# Altium schematic sheet gnss_quectel_lc29hea.SchDoc
size A
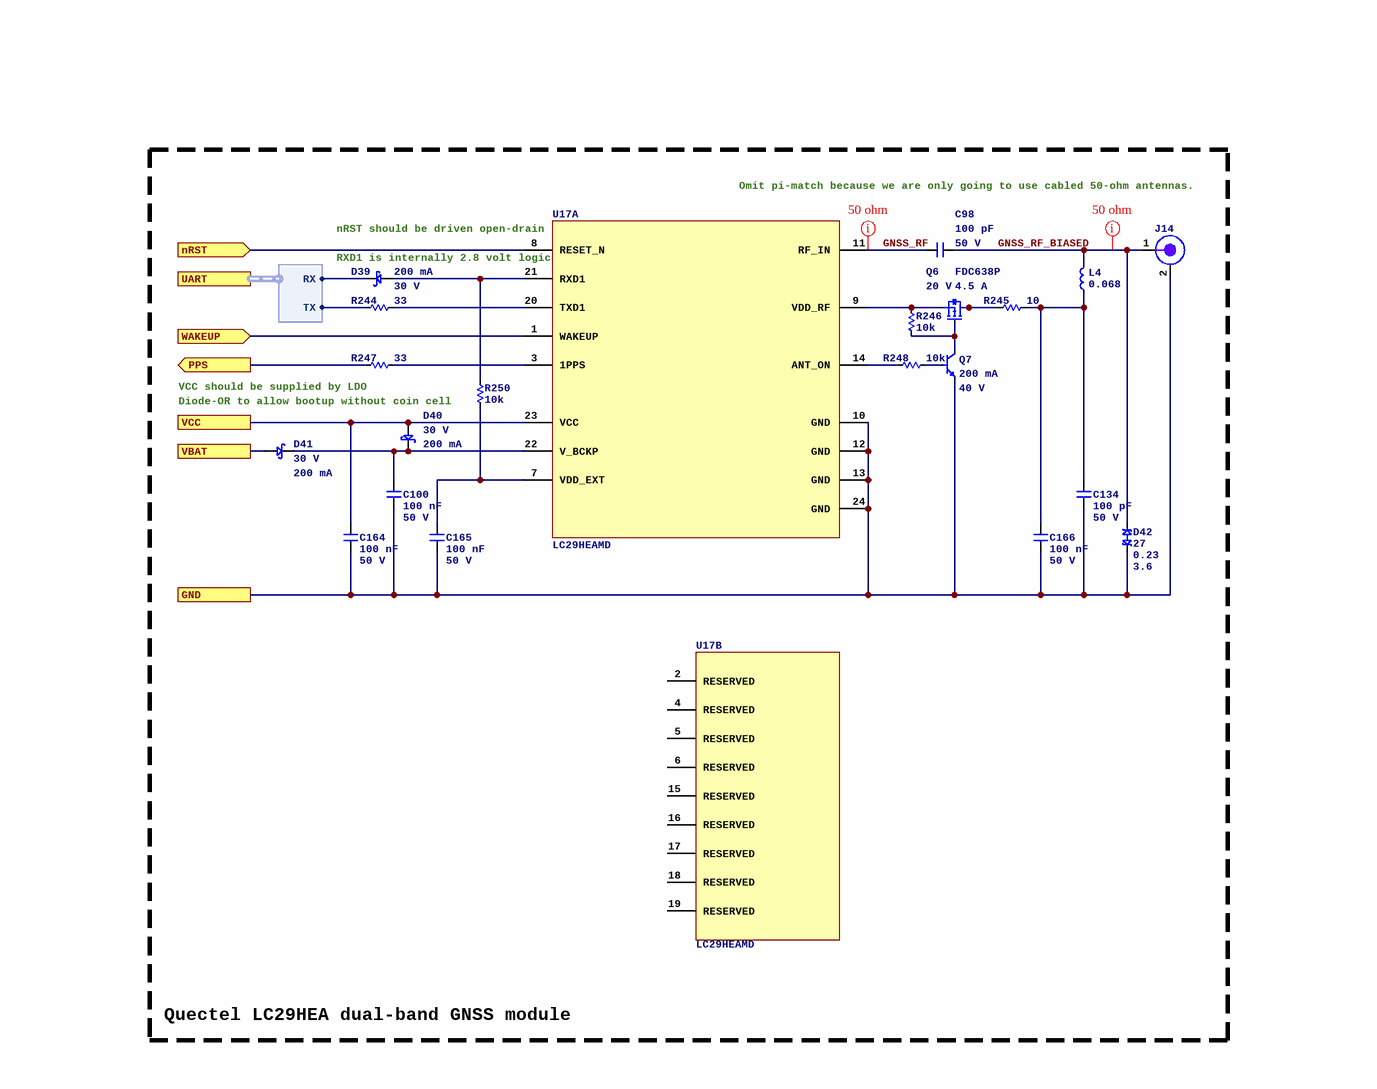
[diagram p0: gnss_quectel_lc29hea.SchDoc]

## Parts
C98  Capacitance: 100 pF  Voltage Rating: 50 V  [C0402]  (hidden comment: 0402CG101J500NT)
C100  Capacitance: 100 nF  Voltage Rating: 50 V  [C0402]  (hidden comment: CL05B104KB54PNC)
C134  Capacitance: 100 pF  Voltage Rating: 50 V  [C0402]  (hidden comment: 0402CG101J500NT)
C164  Capacitance: 100 nF  Voltage Rating: 50 V  [C0402]  (hidden comment: CL05B104KB54PNC)
C165  Capacitance: 100 nF  Voltage Rating: 50 V  [C0402]  (hidden comment: CL05B104KB54PNC)
C166  Capacitance: 100 nF  Voltage Rating: 50 V  [C0402]  (hidden comment: CL05B104KB54PNC)
D39  Current: 200 mA  Vr: 30 V  [SOD523]  (hidden comment: BAT54XV2T1G)
D40  Current: 200 mA  Vr: 30 V  [SOD523]  (hidden comment: BAT54XV2T1G)
D41  Current: 200 mA  Vr: 30 V  [SOD523]  (hidden comment: BAT54XV2T1G)
D42  Power (W): 27  Capacitance (pF): 0.23  Standoff (V): 3.6  [TI_DPY0002A]  (hidden comment: TPD1E01B04DPYR)
J14  RFPC-SMA14-FN-A  [GCT_RFPC-SMA14-FN-A]  (value not drawn)
L4  Inductance (µH): 0.068  [L0603_0.95MM]  (hidden comment: LQW18AN68NJ80D)
Q6  FDC638P  Voltage: 20 V  Current: 4.5 A  [6SOT23]
Q7  Current: 200 mA  Voltage: 40 V  [3SOT523]  (hidden comment: MMBT3904T)
R244  value 33  [R0402]  (hidden comment: 0402WGF330JTCE)
R245  value 10  [R2512]  (hidden comment: RTT2510R0FTE)
R246  value 10k  [R0402]  (hidden comment: 0402WGF1002TCE)
R247  value 33  [R0402]  (hidden comment: 0402WGF330JTCE)
R248  value 10k  [R0402]  (hidden comment: 0402WGF1002TCE)
R250  value 10k  [R0402]  (hidden comment: 0402WGF1002TCE)
U17  LC29HEAMD  [QUECTEL_LC29H]  (parts A,B of 2)

## Ports
GND, nRST (in), PPS (out), UART (harness UART), VBAT, VCC, WAKEUP (in)

## Harnesses
UART: RX, TX

## Nets
GND: C100.2 C134.2 C164.2 C165.2 C166.2 D42.1 J14.2(GND) Q7.2(E) U17.10(GND) U17.12(GND) U17.13(GND) U17.24(GND) ; port GND
GNSS_RF: C98.1 U17.11(RF_IN)
GNSS_RF_BIASED: C98.2 D42.2 J14.1(RF) L4.2
nRST: U17.8(RESET_N) ; port nRST
PPS: R247.2 ; port PPS
VBAT: D41.1 ; port VBAT
VCC: C164.1 D40.1 U17.23(VCC) ; port VCC
WAKEUP: U17.1(WAKEUP) ; port WAKEUP
NetC100_1: C100.1 D40.2 D41.2 U17.22(V_BCKP)
NetC134_1: C134.1 C166.1 L4.1 R245.1
NetC165_1: C165.1 R250.2 U17.7(VDD_EXT)
NetD39_1: D39.1 R250.1 U17.21(RXD1)
NetD39_2: D39.2 ; port UART.RX
NetQ6_1: Q6.1 Q6.2 Q6.5 Q6.6 R245.2
NetQ6_3: Q6.3 Q7.3(C) R246.2
NetQ6_4: Q6.4 R246.1 U17.9(VDD_RF)
NetQ7_1: Q7.1(B) R248.1
NetR244_1: R244.1 U17.20(TXD1)
NetR244_2: R244.2 ; port UART.TX
NetR247_1: R247.1 U17.3(1PPS)
NetR248_2: R248.2 U17.14(ANT_ON)

Not connected (* = marked no-connect by the designer): U17 2(RESERVED) 4(RESERVED) 5(RESERVED) 6(RESERVED) 15(RESERVED) 16(RESERVED) 17(RESERVED) 18(RESERVED) 19(RESERVED)

## Layout directives
net class SE_50: GNSS_RF, GNSS_RF_BIASED

## Notes on the sheet
- nRST should be driven open-drain
- Omit pi-match because we are only going to use cabled 50-ohm antennas.
- (near D39) RXD1 is internally 2.8 volt logic
- VCC should be supplied by LDO
- Diode-OR to allow bootup without coin cell
- Quectel LC29HEA dual-band GNSS module

## Library data of the parts
C98 C134 = 0402CG101J500NT: Manufacturer: FH(Guangdong Fenghua Advanced Tech); Dielectric: C0G; ComponentLink1URL: https://wmsc.lcsc.com/wmsc/upload/file/pdf/v2/lcsc/2304140030_FH--Guangdong-Fenghua-Advanced-Tech-0402CG101J500NT_C1546.pdf; ComponentLink1Description: Datasheet; Manufacturer Part Number: 0402CG101J500NT; Package: 0402; Supplier 2: LCSC; Supplier Part Number 2: C1546
C100 C164-C166 = CL05B104KB54PNC: Manufacturer: Samsung Electro-Mechanics; Dielectric: X7R; ComponentLink1URL: https://wmsc.lcsc.com/wmsc/upload/file/pdf/v2/lcsc/2304140030_Samsung-Electro-Mechanics-CL05B104KB54PNC_C307331.pdf; ComponentLink1Description: Datasheet; Manufacturer Part Number: CL05B104KB54PNC; Package: 0402; Supplier 2: LCSC; Supplier Part Number 2: C307331
D39-D41 = BAT54XV2T1G: ON Semi BAT54XV2T1G; SMT Schottky Diode; 30V 200mA; 5ns; 2-Pin SOD-523; Manufacturer: onsemi; Supplier 1: DigiKey; Supplier Part Number 1: BAT54XV2T1GOSCT-ND; Manufacturer Part Number: BAT54XV2T1G; Supplier 2: LCSC; Supplier Part Number 2: C81572; ComponentLink1Description: Datasheet; ComponentLink1URL: https://www.onsemi.com/pdf/datasheet/bat54xv2t1-d.pdf; Diode Type: Schottky; Supplier 3: Mouser; Supplier Part Number 3: 863-BAT54XV2T1G
D42 = TPD1E01B04DPYR: 3.6 V bidirectional ESD protection diode for high-speed data lines; Manufacturer: Texas Instruments; Supplier 1: DigiKey; Supplier Part Number 1: 296-48721-1-ND; Manufacturer Part Number: TPD1E01B04DPYR; ComponentLink1URL: https://www.ti.com/lit/ds/symlink/tpd1e01b04.pdf; ComponentLink1Description: Datasheet; Polarity: Bidirectional; Supplier 2: LCSC; Supplier Part Number 2: C779389; Supplier 3: Mouser; Supplier Part Number 3: 595-TPD1E01B04DPYR
J14 = RFPC-SMA14-FN-A: SMA Connector Jack, Female Socket Panel Mount, Through Hole, Right Angle Solder, IP68 unmated; Manufacturer: GCT (Gradconn); Supplier 1: DigiKey; Supplier Part Number 1: 2072-RFPC-SMA14-FN-A-ND; Manufacturer Part Number: RFPC-SMA14-FN-A; ComponentLink1Description: Datasheet; ComponentLink1URL: https://www.gradconn.com/Files/Drawings/RFPC-SMA14-FN.pdf; Supplier 2: LCSC; Supplier Part Number 2: C3173272; Supplier 3: Mouser; Supplier Part Number 3: 640-RFPCSMA14FNA
L4 = LQW18AN68NJ80D: 68 nH chip inductor, ±5%; Manufacturer: Murata; Current Rating (mA): 630; DCR (mOhms): 380; Supplier 1: DigiKey; Supplier Part Number 1: LQW18AN68NJ80D-ND; Manufacturer Part Number: LQW18AN68NJ80D; Supplier 2: LCSC; Supplier Part Number 2: C269832; Supplier 3: Mouser; Supplier Part Number 3: 81-LQW18AN68NJ80D; ComponentLink1Description: Datasheet; ComponentLink1URL: https://www.mouser.com/datasheet/2/281/1/JELF243A_0102-3158940.pdf
Q6 = FDC638P: MOSFET P-CH 20V 4.5A SSOT-6; Manufacturer: onsemi; Channel Type: P-channel; Supplier 1: DigiKey; ComponentLink1URL: https://www.onsemi.com/pdf/datasheet/fdc638p-d.pdf; ComponentLink1Description: Datasheet; Supplier Part Number 1: FDC638PCT-ND; Manufacturer Part Number: FDC638P; Supplier 2: LCSC; Supplier Part Number 2: C241772; Supplier 3: Mouser; Supplier Part Number 3: 512-FDC638P
Q7 = MMBT3904T: Bipolar (BJT) Transistor NPN 40 V 200 mA 300MHz 150 mW Surface Mount SOT-523; Manufacturer: Shenzhen Slkormicro Semicon Co., Ltd.; Supplier 1: DigiKey; Supplier Part Number 1: 5399-MMBT3904TCT-ND; Manufacturer Part Number: MMBT3904T; ComponentLink1Description: Datasheet; ComponentLink1URL: https://mm.digikey.com/Volume0/opasdata/d220001/medias/docus/7136/5399_MMBT3904T%20SOT-523.pdf; Supplier 2: LCSC; Supplier Part Number 2: C61616; Polarity: NPN
R244 R247 = 0402WGF330JTCE: Manufacturer: UNI-ROYAL(Uniroyal Elec); Tolerance: 1%; Temperature Coefficient: ±100ppm/?; Power Rating (mW): 62.5; ComponentLink1Description: Datasheet; ComponentLink1URL: https://wmsc.lcsc.com/wmsc/upload/file/pdf/v2/lcsc/2205311900_UNI-ROYAL-Uniroyal-Elec-0402WGF330JTCE_C25105.pdf; Manufacturer Part Number: 0402WGF330JTCE; Package: 0402; Supplier 2: LCSC; Supplier Part Number 2: C25105
R245 = RTT2510R0FTE: Manufacturer: RALEC; Tolerance: 1%; Temperature Coefficient: ±100ppm/?; Power Rating (mW): 1000; ComponentLink1Description: Datasheet; ComponentLink1URL: https://wmsc.lcsc.com/wmsc/upload/file/pdf/v2/lcsc/2304140030_RALEC-RTT2510R0FTE_C105071.pdf; Manufacturer Part Number: RTT2510R0FTE; Package: 2512; Supplier 2: LCSC; Supplier Part Number 2: C105071
R246 R248 R250 = 0402WGF1002TCE: Manufacturer: UNI-ROYAL(Uniroyal Elec); Tolerance: 1%; Temperature Coefficient: ±100ppm/?; Power Rating (mW): 62.5; ComponentLink1Description: Datasheet; ComponentLink1URL: https://wmsc.lcsc.com/wmsc/upload/file/pdf/v2/lcsc/2206010100_UNI-ROYAL-Uniroyal-Elec-0402WGF1002TCE_C25744.pdf; Manufacturer Part Number: 0402WGF1002TCE; Package: 0402; Supplier 2: LCSC; Supplier Part Number 2: C25744
U17 = LC29HEAMD: Rf Txrx Module Navigation SMD; Manufacturer: Quectel; Manufacturer Part Number: LC29HEAMD; Supplier 1: DigiKey; Supplier Part Number 1: 2958-LC29HEAMDCT-ND; Supplier 2: LCSC; Supplier Part Number 2: C28453488; Supplier 3: Mouser; Supplier Part Number 3: 277--LC29HEAMD; ComponentLink1Description: Datasheet; ComponentLink1URL: https://www.quectel.com/content/uploads/2026/03/Quectel_LC29H_Series_GNSS_Module_Specification_V2.0.pdf